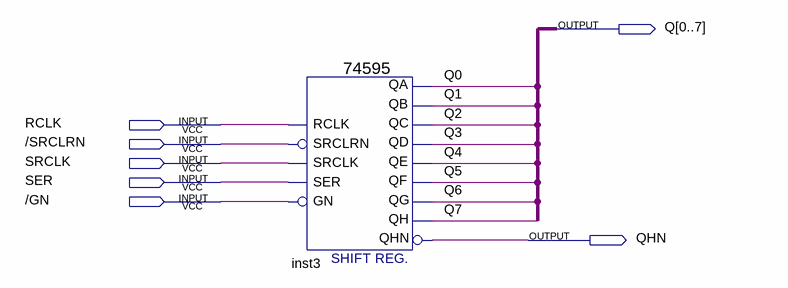
[diagram p0: schematic sheet]
// Quartus schematic port_expand.bdf as structural Verilog: 1 symbols, 7 pins
module port_expand (
  input  RCLK,
  input  \/SRCLRN ,
  input  SRCLK,
  input  SER,
  input  \/GN ,
  output [0:7] Q,
  output QHN
);

  \74595  inst3 (
    .RCLK(RCLK), .SRCLRN(\/SRCLRN ), .SRCLK(SRCLK), .SER(SER), .GN(\/GN ), .QHN(QHN), .QH(Q[7]), .QG(Q[6]),
    .QF(Q[5]), .QE(Q[4]), .QC(Q[2]), .QD(Q[3]), .QA(Q[0]), .QB(Q[1]));
endmodule
